# EAGLE design uuni (EAGLE 6.4)
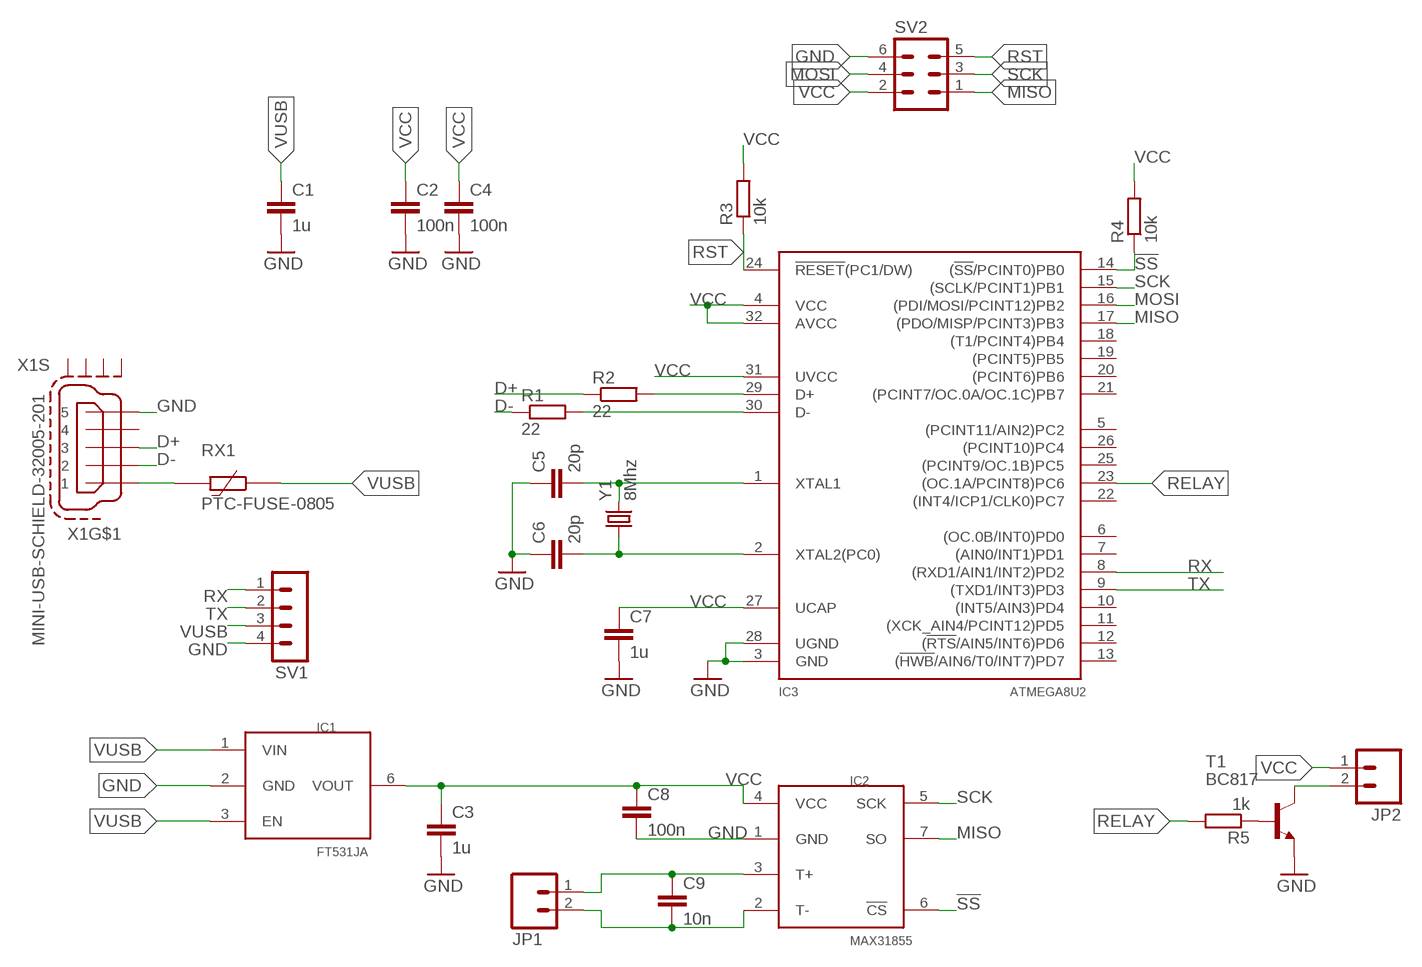
[diagram p0: schematic, sheet 1]

## Parts
C1  1u  C-EUC0603  [C0603]
C2  100n  C-EUC0603  [C0603]
C3  1u  C-EUC0603  [C0603]
C4  100n  C-EUC0603  [C0603]
C5  20p  C-EUC0603  [C0603]
C6  20p  C-EUC0603  [C0603]
C7  1u  C-EUC0603  [C0603]
C8  100n  C-EUC0603  [C0603]
C9  10n  C-EUC0603  [C0603]
IC1  FT531JA  [SC-74]
IC2  MAX31855  [SO8]
IC3  ATMEGA8U2  [TQFP32-08]
JP1  M025MM  [SCREWTERMINAL-5MM-2]
JP2  M02LOCK  [1X02_LOCK]
R1  22  R-EU_R0603  [R0603]
R2  22  R-EU_R0603  [R0603]
R3  10k  R-EU_R0603  [R0603]
R4  10k  R-EU_R0603  [R0603]
R5  1k  R-EU_R0603  [R0603]
RX1  PTC-FUSE-0805  [R0805]
SV1  MA04-1  [MA04-1]
SV2  MA03-2  [MA03-2]
T1  BC817  BC817-40-NPN-SOT23-BEC  [SOT23-BEC]
X1  MINI-USB-SCHIELD-32005-201  [32005-201]
Y1  8Mhz  CRYSTALSMD  [HC49UP]

## Nets
!SS: IC2.6(!CS) IC3.14((!SS!/PCINT0)PB0) R4.1
D+: R2.1 X1.3
D-: R1.1 X1.2
GND: C1.2 C2.2 C3.2 C4.2 C5.1 C6.1 C7.2 C8.2 IC1.2(GND) IC2.1(GND) IC3.3(GND) IC3.28(UGND) SV1.4 SV2.6 T1.E X1.5
MISO: IC2.7(SO) IC3.17((PDO/MISP/PCINT3)PB3) SV2.1
MOSI: IC3.16((PDI/MOSI/PCINT12)PB2) SV2.4
N$1: C5.2 IC3.1(XTAL1) Y1.2
N$2: C6.2 IC3.2(XTAL2(PC0)) Y1.1
N$3: C9.1 IC2.3(T+) JP1.1
N$4: C9.2 IC2.2(T-) JP1.2
N$5: IC3.29(D+) R2.2
N$6: IC3.30(D-) R1.2
N$7: RX1.1 X1.1
N$13: JP2.2 T1.C
N$14: R5.1 T1.B
RELAY: IC3.23((OC.1A/PCINT8)PC6) R5.2
RST: IC3.24(!RESET!(PC1/DW)) R3.1 SV2.5
RX: IC3.8((RXD1/AIN1/INT2)PD2) SV1.1
SCK: IC2.5(SCK) IC3.15((SCLK/PCINT1)PB1) SV2.3
TX: IC3.9((TXD1/INT3)PD3) SV1.2
VCC: C2.1 C3.1 C4.1 C7.1 C8.1 IC1.6(VOUT) IC2.4(VCC) IC3.4(VCC) IC3.27(UCAP) IC3.31(UVCC) IC3.32(AVCC) JP2.1 R3.2 R4.2 SV2.2
VUSB: C1.1 IC1.1(VIN) IC1.3(EN) RX1.2 SV1.3
Unconnected: IC3.5((PCINT11/AIN2)PC2) IC3.6((OC.0B/INT0)PD0) IC3.7((AIN0/INT1)PD1) IC3.10((INT5/AIN3)PD4) IC3.11((XCK_AIN4/PCINT12)PD5) IC3.12((!RTS!/AIN5/INT6)PD6) IC3.13((!HWB!/AIN6/T0/INT7)PD7) IC3.18((T1/PCINT4)PB4) IC3.19((PCINT5)PB5) IC3.20((PCINT6)PB6) IC3.21((PCINT7/OC.0A/OC.1C)PB7) IC3.22((INT4/ICP1/CLK0)PC7) IC3.25((PCINT9/OC.1B)PC5) IC3.26((PCINT10)PC4) X1.4 X1.M1(S:S1) X1.M2(S:S2) X1.M3(S:S3) X1.M4(S:S4)

## Library data of the parts
C1-C9 = rcl:C-EU: CAPACITOR, European symbol
IC1 = uuni:FT531JA
IC2 = uuni:MAX31855
IC3 = hf:ATMEGA8U2: Atmel ATMEGA8U2 microprocessor in TQFP32 package
JP1 JP2 = uuni:M02: Header 2 Standard 2-pin 0.1" header. Use with straight break away headers (SKU : PRT-00116), right angle break away headers (PRT-00553), swiss pins (PRT-00743), machine pins (PRT-00117), and female headers (PRT-00115). Molex polarized connector foot print use with SKU : PRT-08233 with associated crimp pins and housings.
R1-R5 = rcl:R-EU_: RESISTOR, European symbol
RX1 = hf:PTC-FUSE-0805: PTC Dummy
SV1 = con-lstb:MA04-1: PIN HEADER; OC_FARNELL: unknown; OC_NEWARK: unknown
SV2 = uuni:MA03-2: PIN HEADER; OC_FARNELL: unknown; OC_NEWARK: unknown
T1 = transistor:*-NPN-: NPN Transistror BF959 corrected 2008.03.06
X1 = hf:MINI-USB-SCHIELD-: MINI USB-B Conector Source: www.cypressindustries.com; OC_FARNELL: unknown; OC_NEWARK: unknown
Y1 = SparkFun-FreqCtrl:CRYSTAL: Various standard crystals. Proven footprints. Spark Fun Electronics SKU : COM-00534

## Board
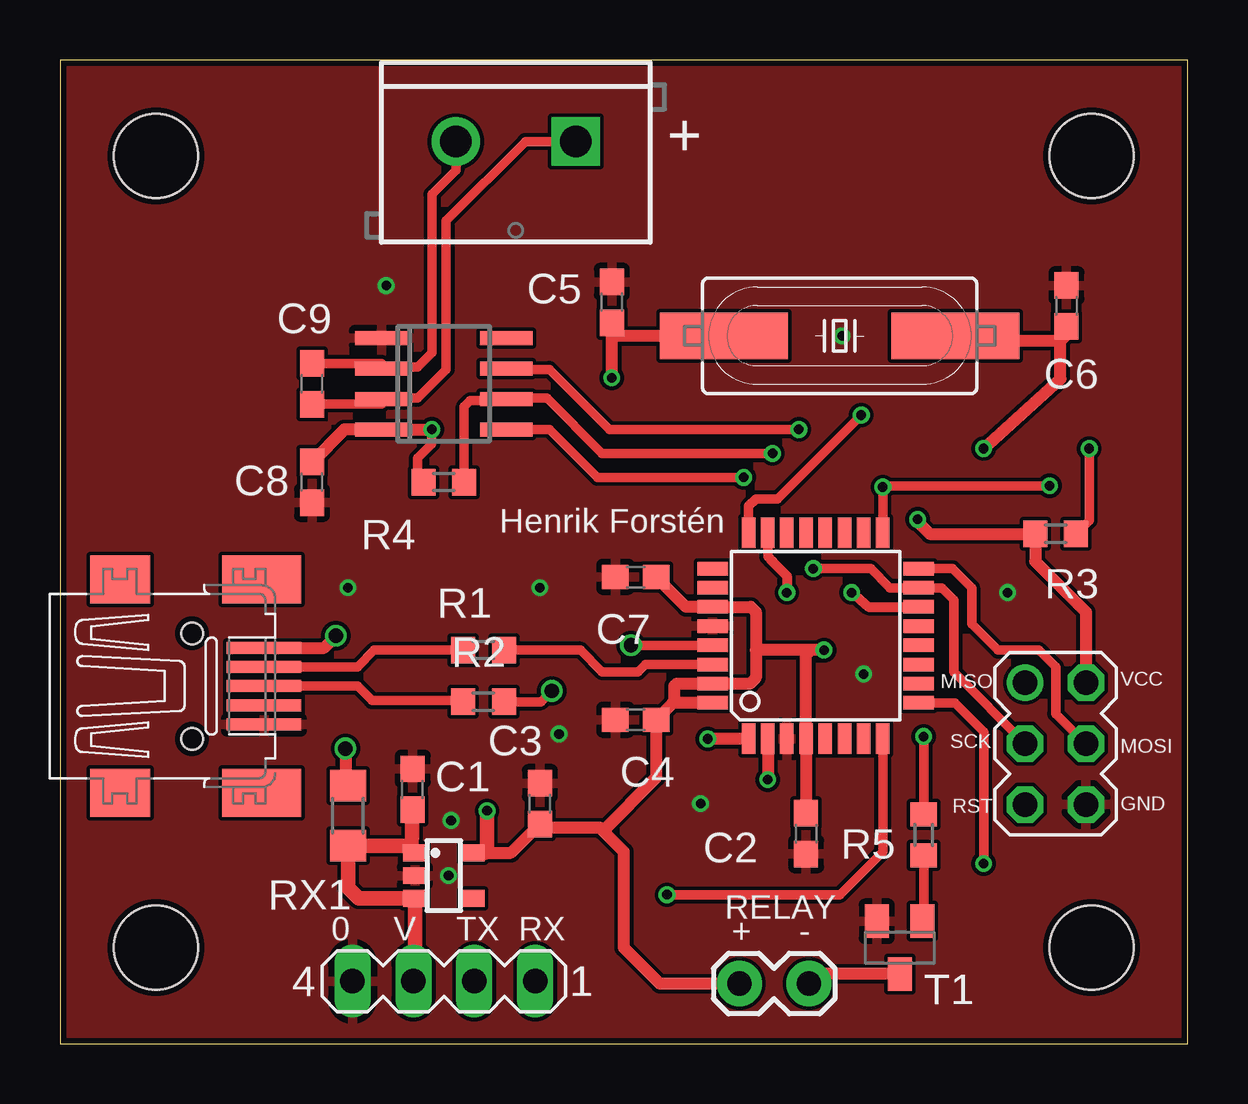
[diagram p1: board, top side]
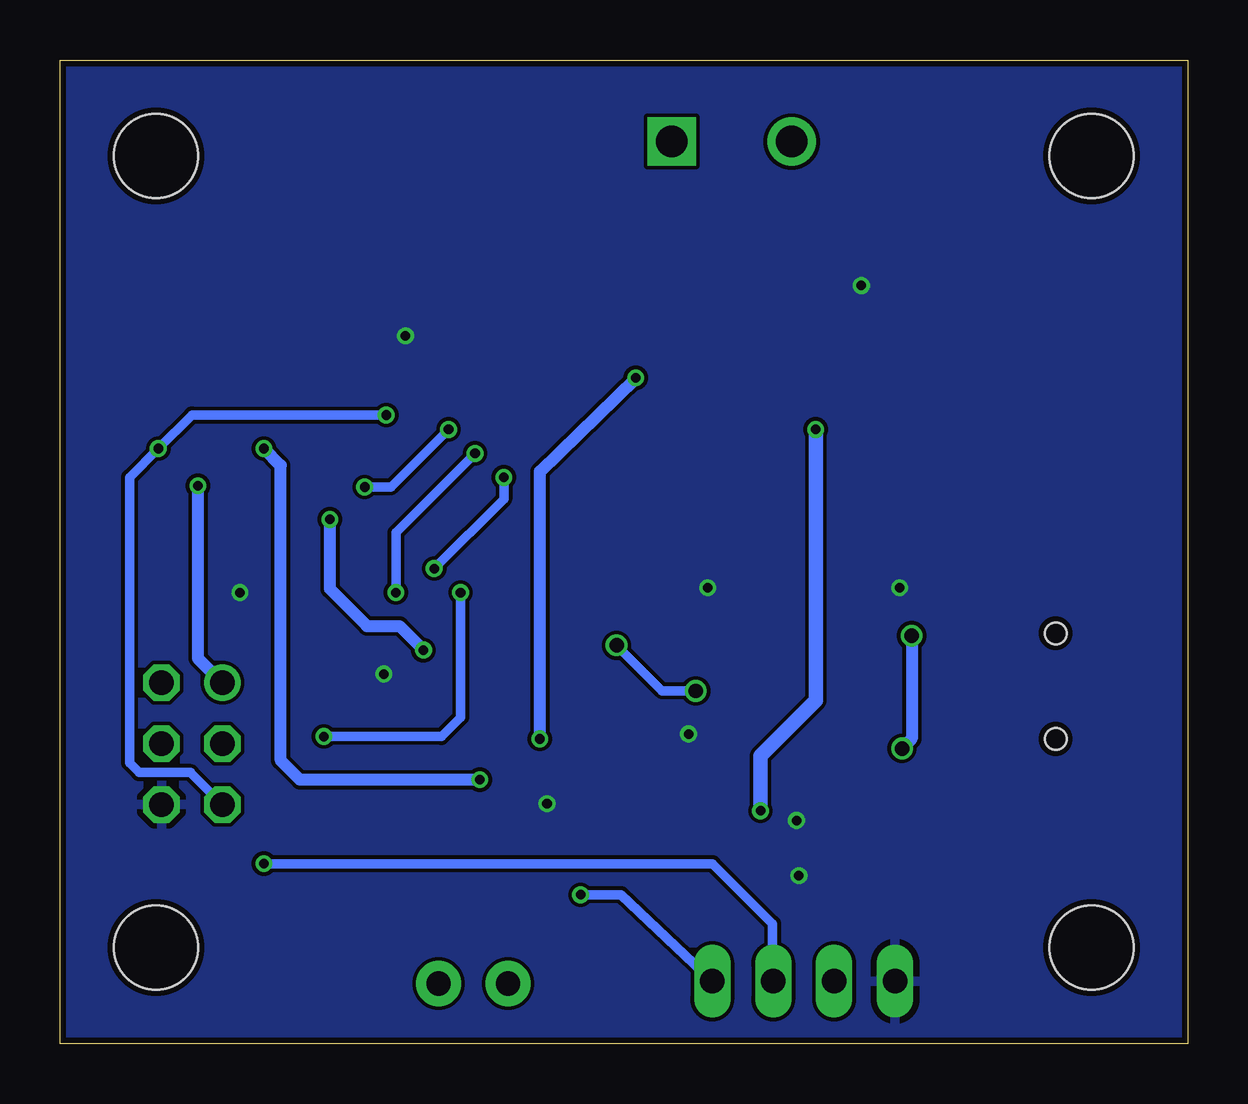
[diagram p2: board, bottom side, seen from below]

Size 47 x 41 mm. Coordinates in mm from the lower left corner, seen from the top.
Outline: 0,0 47,0 47,41 0,41 0,0
Copper layers (1*16): Top 0.035mm / dielectric 1.5mm / Bottom 0.035mm
Design rules "ITEADstudio_DRC": minimum track width 6mil, minimum drill 12mil, track to track 6mil, track to pad 6mil, pad to pad 6mil, via to via 6mil, smd to smd 0mil, copper to edge 10mil, drill to drill 10mil, minimum pad ring 10mil, minimum via ring 6mil, stop-mask expansion 2mil, vias tented up to drill 100mil, thermal gap 10mil
Holes 3.5 mm at 4,37 4,4 43,4 43,37

### Footprints (pad centres in the part's own frame; a part is rotated, then mirrored left to right if it is on the bottom)
C0603 = smd 1.1 x 1: 1 -0.85,0; 2 0.85,0
SC-74 = smd 0.7 x 1: 1 -0.95,-1.2; 2 0,-1.2; 3 0.95,-1.2; 4 0.95,1.2; 6 -0.95,1.2
SO8 = smd 0.6 x 2.2: 1 -1.905,-2.6; 2 -0.635,-2.6; 3 0.635,-2.6; 4 1.905,-2.6; 5 1.905,2.6; 6 0.635,2.6; 7 -0.635,2.6; 8 -1.905,2.6
TQFP32-08 = smd 1.27 x 0.559: 1 -4.293,2.8; 2 -4.293,2; 3 -4.293,1.2; 4 -4.293,0.4; 5 -4.293,-0.4; 6 -4.293,-1.2; 7 -4.293,-2; 8 -4.293,-2.8; 17 4.293,-2.8; 18 4.293,-2; 19 4.293,-1.2; 20 4.293,-0.4; 21 4.293,0.4; 22 4.293,1.2; 23 4.293,2; 24 4.293,2.8 | smd 0.559 x 1.27: 9 -2.8,-4.293; 10 -2,-4.293; 11 -1.2,-4.293; 12 -0.4,-4.293; 13 0.4,-4.293; 14 1.2,-4.293; 15 2,-4.293; 16 2.8,-4.293; 25 2.8,4.293; 26 2,4.293; 27 1.2,4.293; 28 0.4,4.293; 29 -0.4,4.293; 30 -1.2,4.293; 31 -2,4.293; 32 -2.8,4.293
SCREWTERMINAL-5MM-2 = drill 1.3 pad 2.032 square: 1 0,0 | drill 1.3 pad 2.032: 2 5,0
1X02_LOCK = drill 1.016 pad 1.88: 1 -0.178,0; 2 2.718,0
R0603 = smd 1 x 1.1: 1 -0.85,0; 2 0.85,0
R0805 = smd 1.3 x 1.5: 1 -1.25,0; 2 1.25,0
MA04-1 = drill 1.016 long: 1 -3.81,0; 2 -1.27,0; 3 1.27,0; 4 3.81,0
MA03-2 = drill 1.016: 1 -2.54,-1.27 | drill 1.016 octagon: 2 -2.54,1.27; 3 0,-1.27; 4 0,1.27; 5 2.54,-1.27; 6 2.54,1.27
SOT23-BEC = smd 1 x 1.4: B -0.95,-1.1; C 0,1.1; E 0.95,-1.1
32005-201 = smd 3.1 x 0.5: 1 3,1.6; 2 3,0.8; 3 3,0; 4 3,-0.8; 5 3,-1.6 | smd 2.5 x 2: M1 -3,-4.45; M2 -3,4.45 | smd 3.3 x 2: M3 2.9,4.45; M4 2.9,-4.45 | hole 0.9: 0,2.2; 0,-2.2
HC49UP = smd 5.334 x 1.93: 1 -4.826,0; 2 4.826,0

### Placement (x,y rotation side)
C1  14.7,10.6 90 top
C2  31.1,8.75 270 top
C3  20,10 90 top
C4  24,13.5 180 top
C5  23,30.9 270 top
C6  41.95,30.75 270 top
C7  24,19.45 180 top
C8  10.5,23.4 270 top
C9  10.5,27.5 90 top
IC1  16,7 270 top
IC2  16,27.5 270 top
IC3  31.5,17 90 top
JP1  21.5,37.6 180 top
JP2  28.5,2.5 0 top
R1  17.65,16.4 0 top
R2  17.65,14.25 0 top
R3  41.5,21.25 180 top
R4  16,23.4 180 top
R5  36,8.7 90 top
RX1  12,9.5 270 top
SV1  16,2.6 180 top
SV2  41.5,12.5 270 top
T1  35,4 180 top
X1  5.5,14.9 0 top
Y1  32.5,29.5 180 top

### Tracks (layer width: path | path; a pad name or v marks a point on that pad's centre or on a via)
!SS  (via drill 0.4)
  Top 0.4: 18.64,26.9 20.3,26.9 22.6,24.6 v29.7,24.6 | v33,18.8 33.7,18.2 | R4.1 16.85,26.55 17.1,26.8 18.54,26.8 IC2.6
  Top 0.406: 33.7,18.2 IC3.14
  Top 0.5: IC2.6 18.64,26.9
  Bottom 0.4: v33,18.8 33,21.3 v29.7,24.6
D+
  Top 0.4: X1.3 12.4,14.9 13,14.3 16.75,14.3 R2.1
D-
  Top 0.4: X1.2 12.4,15.7 13.1,16.4 R1.1
GND  (via drill 0.4)
  other vias: 39.5,18.8 32.6,29.5 13.6,31.6 26.7,10 20.8,12.9 12,19 33.5,15.4 20,19 16.2,7 16.3,9.3
  pour Top: -5,53 53.5,53 53.5,-2.5 -5,-2.5
  pour Bottom: -1.1,42.1 48.5,42.1 48.5,-1.3 -1.1,-1.3
MISO  (via drill 0.4)
  Top 0.4: 18.64,28.1 20.4,28.1 22.9,25.6 v30.8,25.6 | IC3.17 v34.3,23.2 34.35,23.25 v41.25,23.25
  Top 0.5: 18.86,28.14 IC2.7 18.64,28.1
  Bottom 0.4: v30.8,25.6 33.2,23.2 v34.3,23.2
  Bottom 0.5: v41.25,23.25 41.25,16.06 SV2.1
MOSI
  Top 0.4: IC3.16 37.2,19.8 38,19 38,17.5 39.1,16.4 40.8,16.4 41.5,15.7 41.5,13.75 41.52,13.75 SV2.4
N$1  (via drill 0.4)
  Top 0.5: IC3.1 27.21,12.71 v27,12.7 | v23,27.75 C5.2 23.15,29.5 Y1.2
  Bottom 0.5: v27,12.7 27,23.85 v23,27.75
N$2  (via drill 0.4)
  Top 0.5: Y1.1 37.53,29.3 41.7,29.3 | 41.7,29.3 42.15,29.75 C6.2 | v38.5,24.8 41.7,27.7 41.7,29.3 | IC3.2 v29.5,11
  Bottom 0.5: v29.5,11 37,11 37.8,11.8 37.8,24.1 v38.5,24.8
N$3
  Top 0.4: C9.1 13.4,26.65 IC2.3 13.44,26.9 14.9,26.9 16.1,28.1 16.1,34.3 19.4,37.6 JP1.1
N$4
  Top 0.4: C9.2 13.4,28.35 IC2.2 13.46,28.2 14.9,28.2 15.5,28.8 15.5,35.4 16.5,36.4 JP1.2
N$5  (via drill 0.6)
  Top 0.4: R2.2 20.05,14.25 v20.5,14.7 | v23.8,16.6 IC3.29
  Bottom 0.4: v20.5,14.7 21.9,14.7 v23.8,16.6
N$6
  Top 0.4: IC3.30 24.4,15.8 24.1,15.5 22.6,15.5 21.7,16.4 R1.2
N$7  (via drill 0.6)
  Top 0.5: X1.1 11,16.5 v11.5,17 | v11.9,12.3 11.9,10.85 RX1.1
  Bottom 0.5: v11.5,17 11.5,12.7 v11.9,12.3
N$13
  Top 0.5: T1.C 31.62,2.9 JP2.2
N$14
  Top 0.4: R5.1 36,5.15 T1.B
RELAY  (via drill 0.4)
  Top 0.4: v36,12.8 R5.2 | 29.7,20.1 29.5,20.3 IC3.23
  Top 0.406: 29.7,20.1 30.3,19.5 v30.3,18.8
  Bottom 0.4: v36,12.8 31.1,12.8 30.3,13.6 v30.3,18.8
RST  (via drill 0.4)
  Top 0.4: R3.1 42.9,21.8 v42.9,24.8 | v33.4,26.2 29.9,22.7 29,22.7 28.7,22.4 IC3.24
  Bottom 0.4: v33.4,26.2 41.5,26.2 v42.9,24.8 44.1,23.6 44.1,11.7 43.7,11.3 41.55,11.3 41.55,11.28 SV2.5
RX  (via drill 0.4)
  Top 0.4: v25.3,6.2 32.5,6.2 34.3,8 IC3.8
  Bottom 0.4: SV1.1 23.61,6.2 v25.3,6.2
SCK  (via drill 0.4)
  Top 0.4: v31.4,19.8 33.8,19.8 34.6,19 IC3.15 36.75,19 37.25,18.5 37.25,15.48 SV2.3 | v28.5,23.6 22.4,23.6 20.41,25.59 IC2.5
  Bottom 0.4: v28.5,23.6 28.5,22.7 v31.4,19.8
TX  (via drill 0.4)
  Top 0.4: v38.5,7.5 38.5,13 37.3,14.2 IC3.9
  Bottom 0.4: v38.5,7.5 19.8,7.5 17.3,5 17.3,2.63 SV1.2
VCC  (via drill 0.4)
  Top 0.4: v15.49,25.59 15.49,25 14.9,24.4 14.9,23.65 R4.2 | 25.6,14.25 25.55,14.2
  Top 0.5: IC1.6 17.7,7.95 18.8,7.95 C3.1 20.15,9 22.5,9 22.62,8.88 | JP2.1 25,2.5 23.5,4 23.5,8 22.62,8.88 | 29,16.4 29,18 28.8,18.2 IC3.27 26.1,18.2 C7.1 24.75,19.45 | 29,16.4 29,15.25 28.75,15 IC3.31 25.7,15 25.6,14.9 25.6,14.25 | IC3.32 25.55,14.2 C4.1 24.85,11.1 22.62,8.88 | C2.1 IC3.4 31.1,16.2 31.3,16.4 | v35.75,21.85 35.75,21.75 36.25,21.25 R3.2 40.65,20.1 42.77,17.98 SV2.2 | v31.85,16.4 31.3,16.4 | 31.3,16.4 29,16.4 | C8.1 11.85,25.59 IC2.4 v15.49,25.59 v15.5,25.6
  Top 0.6: v17.8,9.7 17.8,8.05 17.7,7.95
  Bottom 0.5: v35.75,21.85 35.75,18.95 34.2,17.4 32.85,17.4 v31.85,16.4
  Bottom 0.6: v17.8,9.7 17.8,12 15.5,14.3 v15.5,25.6
VUSB
  Top 0.6: C1.1 14.65,8.1 IC1.1 14.5,8.25 RX1.2 12,6.5 12.45,6.05 IC1.3 14.8,2.57 SV1.3

### Text on the board
tPlace: + | Henrik Forstén | MISO | VCC | SCK | MOSI | RST | GND | RELAY | 0 | V | TX | RX | + | -